# EAGLE design geiger_module (EAGLE 9.5.2)
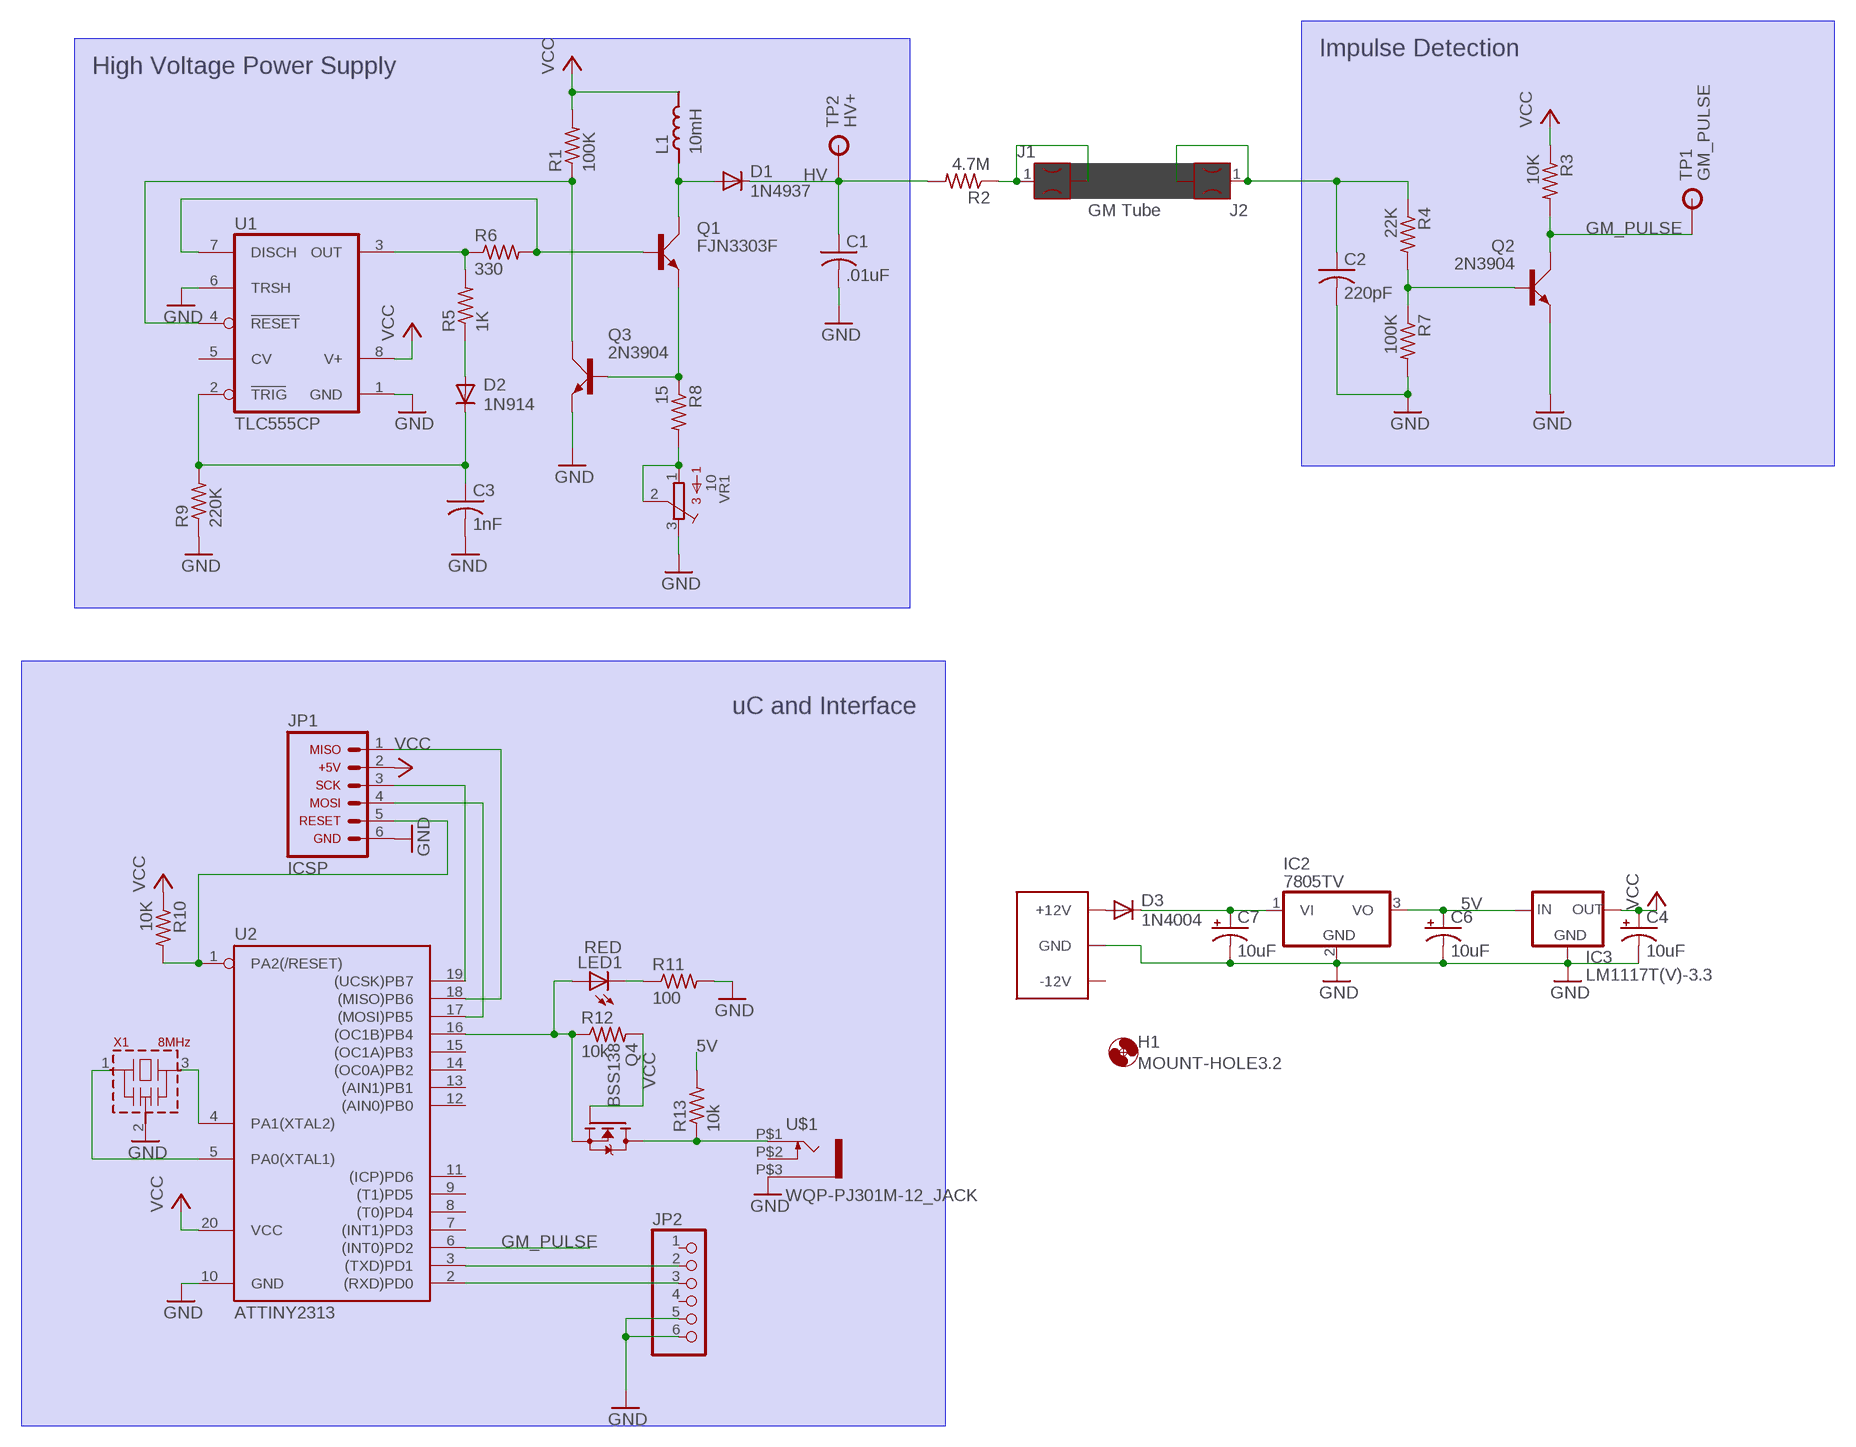
[diagram p0: schematic, sheet 1]

## Parts
C1  .01uF  C-US102-043X133  [C102-043X133]
C2  220pF  C-US050-030X075  [C050-030X075]
C3  1nF  C-US050-025X075  [C050-025X075]
C4  10uF  10UF-POLAR-RADIAL-2.5MM-25V-20%  [CPOL-RADIAL-2.5MM-5MM]
C6  10uF  10UF-POLAR-RADIAL-2.5MM-25V-20%  [CPOL-RADIAL-2.5MM-5MM]
C7  10uF  10UF-POLAR-RADIAL-2.5MM-25V-20%  [CPOL-RADIAL-2.5MM-5MM]
C8  EURO_POWER_LOCKSKINNY  [EURO_POWER_HEADER]
D1  1N4937  1N4933  [DO41-10]
D2  1N914  1N4148DO35-7  [DO35-7]
D3  1N4004  [DO41-10]
H1  MOUNT-HOLE3.2  [3,2]
IC2  7805TV  [TO220V]
IC3  LM1117T(V)-3.3  [TO220V]
J1  FUSECLIPPCMOUNT  [FUSECLIP_PCMOUNT]
J2  FUSECLIPPCMOUNT  [FUSECLIP_PCMOUNT]
JP1  ARDUINO_CONN-ICSP  [CONN-2X03]
JP2  PINHD-1X6  [1X06]
L1  10mH  INDELC09D  [ELC09D]
LED1  RED  LED5MM  [LED5MM]
Q1  FJN3303F  2N3704  [TO92C]
Q2  2N3904  [TO92D]
Q3  2N3904  [TO92D]
Q4  BSS138  [SOT23]
R1  100K  R-US_0207/10  [0207/10]
R2  4.7M  R-US_0207/10  [0207/10]
R3  10K  R-US_0207/10  [0207/10]
R4  22K  R-US_0207/10  [0207/10]
R5  1K  R-US_0207/10  [0207/10]
R6  330  R-US_0207/10  [0207/10]
R7  100K  R-US_0207/10  [0207/10]
R8  15  R-US_0207/10  [0207/10]
R9  220K  R-US_0207/10  [0207/10]
R10  10K  R-US_0207/10  [0207/10]
R11  100  R-US_0207/10  [0207/10]
R12  10k  R-US_0207/10  [0207/10]
R13  10k  R-US_0207/10  [0207/10]
TP1  GM_PULSE  TPPTH  [TP_PTH]
TP2  HV+  TPPTH  [TP_PTH]
U1  TLC555CP  ICM7555  [DIL08]
U2  ATTINY2313  TINY2313-*P*  [DIL20]
U$1  WQP-PJ301M-12_JACK  [WQP-PJ301M-12_JACK]
VR1  10  3386-P  [3386P]
X1  8MHz  CSTLA_T  [CSTLA_T]

## Nets
5V: C6.1(+) IC2.3(VO) IC3.3(IN) R13.2
12V: C7.1(+) D3.C IC2.1(VI)
GM_PULSE: Q2.C R3.2 TP1.P$1(TP) U2.6((INT0)PD2)
GND: C1.2 C2.2 C3.2 C4.2(-) C6.2(-) C7.2(-) C8.3(GND) C8.4(GND) C8.5(GND) C8.6(GND) C8.7(GND) C8.8(GND) IC2.2(GND) IC3.1(GND) JP1.6 JP2.5 JP2.6 Q2.E Q3.E R7.2 R9.1 R11.2 U1.1(GND) U1.6(TRSH) U2.10(GND) U$1.P$3 VR1.3 X1.2(VSS)
HV: C1.1 D1.C R2.2 TP2.P$1(TP)
N$1: D2.A R5.1
N$2: JP1.5 R10.2 U2.1(PA2(/RESET))
N$3: Q3.C R1.1 U1.4(RESET)
N$4: C8.9(+12V) C8.10(+12V) D3.A
N$5: JP1.3 U2.19((UCSK)PB7)
N$6: JP2.2 U2.3((TXD)PD1)
N$7: JP2.3 U2.2((RXD)PD0)
N$8: Q1.B R6.2 U1.7(DISCH)
N$9: C3.1 D2.C R9.2 U1.2(TRIG)
N$10: R5.2 R6.1 U1.3(OUT)
N$11: Q1.E Q3.B R8.1
N$12: D1.A L1.1 Q1.C
N$13: JP1.1 U2.18((MISO)PB6)
N$14: Q2.B R4.2 R7.1
N$15: J1.1 J1.2 R2.1
N$16: JP1.4 U2.17((MOSI)PB5)
N$18: U2.4(PA1(XTAL2)) X1.3
N$19: U2.5(PA0(XTAL1)) X1.1
N$21: LED1.K(C) R11.1
N$23: R8.2 VR1.1 VR1.2
N$39: C2.1 J2.1 J2.2 R4.1
PIN16: LED1.A Q4.2(S) R12.1 U2.16((OC1B)PB4)
PIN165V: Q4.3(D) R13.1 U$1.P$1
VCC: C4.1(+) IC3.2(OUT) JP1.2 L1.2 Q4.1(G) R1.2 R3.1 R10.1 R12.2 U1.8(V+) U2.20(VCC)
Unconnected: C8.1(-12V) C8.2(-12V) JP2.1 JP2.4 U1.5(CV) U2.7((INT1)PD3) U2.8((T0)PD4) U2.9((T1)PD5) U2.11((ICP)PD6) U2.12((AIN0)PB0) U2.13((AIN1)PB1) U2.14((OC0A)PB2) U2.15((OC1A)PB3) U$1.P$2

## Notes on the sheet
- Impulse Detection
- High Voltage Power Supply
- GM Tube
- uC and Interface

## Library data of the parts
C1-C3 = resistor:C-US: CAPACITOR, American symbol
C4 C6 C7 = SparkFun-Capacitors:10UF-POLAR: 10.0µF polarized capacitors A capacitor is a passive two-terminal electrical component used to store electrical energy temporarily in an electric field.; PROD_ID: CAP-08440
C8 = MusicThingModular:EURO_POWER_LOCK
D1 = diode:1N4933: DIODE fast recovery rectifier, 1A
D2 = diode:1N4148: DIODE high speed (Philips)
D3 = adafruit:1N4004: DIODE General purpose 1N400x type rectifier (With bigger pads) http://www.ladyada.net/library/pcb/eaglelibrary.html
H1 = holes:MOUNT-HOLE: MOUNTING HOLE with drill center marker
IC2 = linear:78*: Positive VOLTAGE REGULATOR Source: http://cache.national.com/ds/LM/LM78L05.pdf http://www.fairchildsemi.com/ds/LM/LM7805.pdf
IC3 = lm1117_10:LM1117?-*: 800mA Low-Dropout Linear Regulator Source: http://www.ti.com/lit/ds/symlink/lm1117-n.pdf; MF: Texas Instruments; MPN: LM1117T-3.3; OC_FARNELL: 1469056; OC_NEWARK: 13B5347
J1 J2 = connectors:FUSECLIP
JP1 = arduino_jw:ARDUINO_CONN-ICSP: Arduino ICSP I/O Header This is the ICSP I/O header on the Arduino Uno R3. This connector is labeled with the following pin assignments: MISO +5V SCK MOSI RESET GND NOTE: Be sure you install this connector with the correct orientation on your PCB layout. Pin 1 has a square pad to assist with orientation.
JP2 = pinhead:PINHD-1X6: PIN HEADER
L1 = passives:IND: Inductor
LED1 = mightyohm:LED: MightyOhm Engineering Light Emitting Diodes (LEDs)
Q1 = transistor-small-signal:2N3704: NPN TRANSISTOR
Q2 Q3 = transistor-small-signal:2N3904: NPN TRANSISTOR
Q4 = bss138_10:BSS138: BSS138 N-Channel Logic Level Enhancement Mode Field Effect Transistor Source: http://www.fairchildsemi.com/datasheets/BS/BSS138.pdf; MF: Fairchild; MPN: BSS138; OC_FARNELL: 9845330; OC_NEWARK: 67R2009
R1-R13 = resistor:R-US_: RESISTOR, American symbol
TP1 TP2 = connectors:TP: Test Point JSK 1/14/11
U1 = maxim:ICM7555: TIMER
U2 = avr-6:TINY2313*: Atmel Tiny2313 2K Flash, 128 bytes EEPROM, 128 bytes RAM
U$1 = thonkiconn:WQP-PJ301M-12_JACK
VR1 = BOURNS:3386-: 3386 Series 3/8" Square Trimmer
X1 = murata-resonators:CSTLA_T: Ceramic resonator 10.01 to 13.00 MHz

## Board
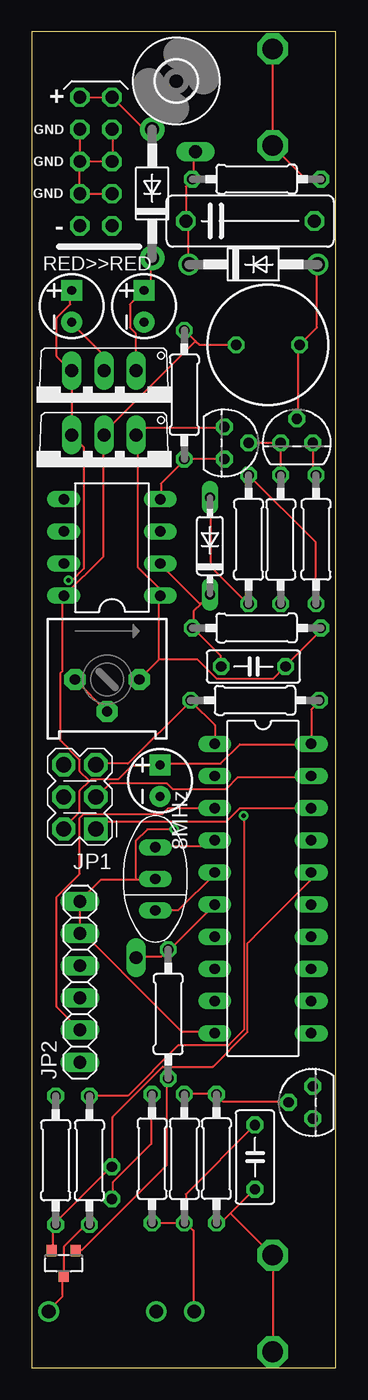
[diagram p1: board, top side]
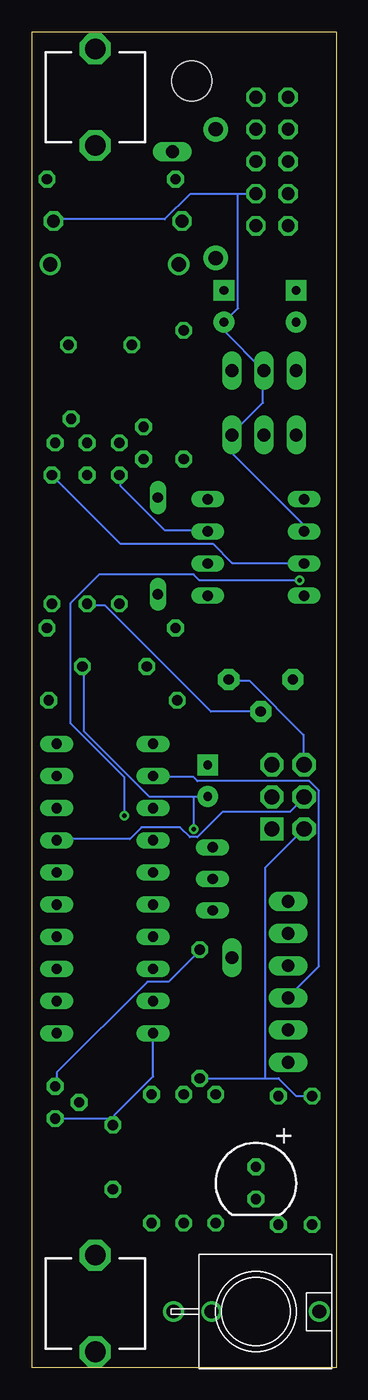
[diagram p2: board, bottom side, seen from below]

Size 24.04 x 105.5 mm. Coordinates in mm from the lower left corner, seen from the top.
Outline: 0,0 24.04,0 24.04,105.5 0,105.5 0,0
Copper layers (1*16): Top 0.035mm / dielectric 1.5mm / Bottom 0.035mm
Design rules "default": minimum track width 6mil, minimum drill 0.35mm, track to track 6mil, track to pad 6mil, pad to pad 6mil, via to via 6mil, smd to smd 6mil, copper to edge 40mil, drill to drill 6mil, minimum pad ring 10mil, minimum via ring 8mil, stop-mask expansion 4mil, vias tented up to drill 0mil, thermal gap 10mil

### Footprints (pad centres in the part's own frame; a part is rotated, then mirrored left to right if it is on the bottom)
C102-043X133 = drill 1.016 octagon: 1 -5.08,0; 2 5.08,0
C050-030X075 = drill 0.813 octagon: 1 -2.54,0; 2 2.54,0
C050-025X075 = drill 0.813 octagon: 1 -2.54,0; 2 2.54,0
CPOL-RADIAL-2.5MM-5MM = drill 0.7 pad 1.651 square: 1 1.25,0 | drill 0.7 pad 1.651: 2 -1.25,0
EURO_POWER_HEADER = drill 1.016 octagon: 1 -5.08,-1.27; 2 -5.08,1.27; 3 -2.54,-1.27; 4 -2.54,1.27; 5 0,-1.27; 6 0,1.27; 7 2.54,-1.27; 8 2.54,1.27; 9 5.08,-1.27; 10 5.08,1.27
DO41-10 = drill 1.118: A 5.08,0; C -5.08,0
DO35-7 = drill 0.813 long: A 3.81,0; C -3.81,0
DO41-10' = drill 1.118 pad 1.93: A 5.08,0; C -5.08,0
3,2 = hole 3.2: 0,0
TO220V = drill 1.016 long: 1 -2.54,-2.54; 2 0,-2.54; 3 2.54,-2.54
FUSECLIP_PCMOUNT = drill 1.626 octagon: 1 0,0; 2 7.62,0
CONN-2X03 = drill 1.2 pad 1.829 square: 1 0,0 | drill 1.2 pad 1.829 octagon: 2 2.54,0; 3 0,-2.54; 4 2.54,-2.54; 5 0,-5.08; 6 2.54,-5.08
1X06 = drill 1.016 long: 1 -6.35,0; 2 -3.81,0; 3 -1.27,0; 4 1.27,0; 5 3.81,0; 6 6.35,0
ELC09D = drill 0.813 octagon: 1 -2.5,0; 2 2.5,0
LED5MM = drill 0.813 octagon: A -1.27,0; K 1.27,0
TO92C = drill 0.813 octagon: B 1.27,0; C 0,1.905; E -1.27,0
TO92D = drill 0.813 octagon: B 0,1.905; C 1.27,0; E -1.27,0
SOT23 = smd 0.8 x 0.9: 1 -0.95,-1; 2 0.95,-1; 3 0,1
0207/10 = drill 0.813 octagon: 1 -5.08,0; 2 5.08,0
TP_PTH = drill 1.016 long: P$1 0,0
DIL08 = drill 0.813 long: 1 -3.81,-3.81; 2 -1.27,-3.81; 3 1.27,-3.81; 4 3.81,-3.81; 5 3.81,3.81; 6 1.27,3.81; 7 -1.27,3.81; 8 -3.81,3.81
DIL20 = drill 0.813 long: 1 -11.43,-3.81; 2 -8.89,-3.81; 3 -6.35,-3.81; 4 -3.81,-3.81; 5 -1.27,-3.81; 6 1.27,-3.81; 7 3.81,-3.81; 8 6.35,-3.81; 9 8.89,-3.81; 10 11.43,-3.81; 11 11.43,3.81; 12 8.89,3.81; 13 6.35,3.81; 14 3.81,3.81; 15 1.27,3.81; 16 -1.27,3.81; 17 -3.81,3.81; 18 -6.35,3.81; 19 -8.89,3.81; 20 -11.43,3.81
WQP-PJ301M-12_JACK = drill 1.1: P$1 0,5; P$2 0,-3.5; P$3 0,-6.5
3386P = drill 0.813 pad 1.676 octagon: 1 -2.54,0; 2 0,-2.54; 3 2.54,0
CSTLA_T = drill 0.813 long: 1 -2.5,0; 2 0,0; 3 2.5,0

### Placement (x,y rotation side)
C1  17.27,90.55 0 top
C2  17.65,16.64 90 top
C3  17.53,55.37 0 top
C4  10.16,46.35 90 top
C6  3.17,83.82 90 top
C7  8.89,83.82 90 top
C8  5.08,95.25 90 top
D1  17.53,87.12 0 top
D2  14.1,64.9 90 top
D3  1N4004  [DO41-10']  9.53,92.71 90 top
H1  11.43,101.6 0 top
IC2  5.71,76.2 180 top
IC3  5.71,71.12 180 top
J1  19.05,96.52 90 bottom
J2  19.05,1.27 90 bottom
JP1  5.08,42.55 180 top
JP2  3.81,30.48 90 top
L1  18.67,80.77 180 top
LED1  6.35,14.61 270 bottom
Q1  20.95,73.03 0 top
Q2  22.23,20.95 90 top
Q3  15.24,73.03 270 top
Q4  2.54,8.26 180 top
R1  12.06,76.83 90 top
R2  17.78,93.85 180 top
R3  10.79,27.94 90 top
R4  14.61,16.51 90 top
R5  17.14,65.41 90 top
R6  22.48,65.41 90 top
R7  12.06,16.51 270 top
R8  19.68,65.41 270 top
R9  17.78,58.42 180 top
R10  17.65,52.7 180 top
R11  9.53,16.51 270 top
R12  1.91,16.38 90 top
R13  4.57,16.38 90 top
TP1  8.26,32.38 270 top
TP2  12.95,96.01 0 top
U1  6.35,64.77 90 top
U2  18.29,37.85 270 top
U$1  6.35,4.45 270 bottom
VR1  5.97,54.36 0 top
X1  9.78,38.61 90 top

### Tracks (layer width: path | path; a pad name or v marks a point on that pad's centre or on a via)
5V  (via drill 0.35)
  Top 0.152: v16.76,43.59 16.76,26.67 15.54,25.45 11.58,25.45 7.62,21.49 4.57,21.49 R13.2 | v2.9,62.18 3.2,62.18 4.12,63.09 4.12,72.69 3.2,73.61 IC3.3 3.2,73.76 3.2,78.64 IC2.3 3.05,78.79 1.98,79.86 1.98,82.91 3.05,83.97 3.05,85.04 C6.1
  Bottom 0.152: v16.76,43.59 16.76,46.63 21.03,50.9 21.03,60.35 18.75,62.64 11.28,62.64 10.82,62.18 v2.9,62.18
12V
  Top 0.152: IC2.1 8.23,78.79 8.23,81.69 7.77,82.14 7.77,83.97 8.84,85.04 C7.1 8.99,85.19 9.45,85.65 9.45,87.63 D3.C
GM_PULSE
  Top 0.152: U2.6 10.82,32.92 R3.2 10.67,32.92 10.21,32.46 8.38,32.46 TP1.P$1
  Bottom 0.152: Q2.C 22.1,22.25 22.1,23.32 14.94,30.48 13.26,30.48 10.82,32.92 R3.2
GND  (via drill 0.35)
  Top 0.152: R11.2 R7.2 12.19,11.43 | 12.19,11.43 12.8,10.82 12.8,4.57 U$1.P$3 | 8.23,38.56 5.49,38.56 3.81,36.88 JP2.6 JP2.5 4.12,34.29 11.89,26.52 14.48,26.52 U2.10 | 8.23,38.56 9.75,38.56 X1.2 | 12.19,11.43 12.19,13.72 C2.2 | 10.06,55.93 10.06,60.96 | 10.06,55.93 8.53,54.41 VR1.3 | R9.1 22.86,58.22 20.12,55.47 C3.2 19.96,55.32 19.05,54.41 14.63,54.41 13.11,55.93 10.06,55.93 | C8.8 C8.6 | C8.7 6.4,97.69 6.4,95.25 C8.5 C8.6 | C8.3 6.25,92.66 3.81,92.66 C8.4 C8.6 | IC2.2 5.64,78.79 5.64,80.01 3.2,82.45 C6.2 | Q3.E 15.24,74.22 8.84,74.22 8.38,73.76 IC3.1 8.38,73.61 8.38,63.25 10.06,61.57 10.06,60.96 | 10.06,60.96 U1.1 | 8.23,38.56 8.23,41.6 9.14,42.52 v11.28,42.52
  Bottom 0.152: U2.10 14.48,23.01 17.53,19.96 17.53,19.66 | 17.53,19.66 17.53,19.2 C2.2 17.53,19.66 | 17.53,19.66 22.1,19.66 Q2.E | JP1.6 2.59,47.7 2.59,49.99 6.86,54.25 8.38,54.25 VR1.3 | 11.28,45.11 14.78,45.11 19.96,50.29 19.96,55.32 C3.2 | 11.28,45.11 10.21,45.11 C4.2 | 7.77,92.66 6.4,92.66 C8.3 | 7.77,92.66 11.58,92.66 13.56,90.68 22.25,90.68 C1.2 | U1.6 2.59,66.14 2.59,66.6 8.23,72.24 8.23,73.61 IC3.1 8.23,73.76 5.79,76.2 5.79,78.64 IC2.2 5.79,78.79 8.84,81.84 8.84,82.45 C7.2 8.84,82.6 7.77,83.67 7.77,92.66 | 11.28,45.11 v11.28,42.52
HV
  Top 0.152: TP2.P$1 12.8,95.86 12.8,93.88 R2.2 12.65,93.73 12.19,93.27 C1.1 12.19,90.53 12.34,90.37 12.34,87.17 D1.C
N$1
  Top 0.152: D2.A 14.17,68.58 14.17,63.25 17.07,60.35 R5.1
N$2
  Top 0.152: U2.1 14.48,50.75 12.65,52.58 R10.2 12.5,52.58 7.62,47.7 5.18,47.7 JP1.5
N$3
  Top 0.152: U1.4 10.21,68.58 10.21,69.8 12.04,71.63 R1.1 12.19,71.78 15.24,71.78 Q3.C
N$4
  Top 0.152: C8.10 3.81,100.28 6.25,100.28 C8.9 8.84,97.84 9.45,97.84 D3.A
N$5
  Top 0.152: U2.19 22.1,46.63 16.31,46.63 15.39,45.72 11.12,45.72 10.67,46.18 6.25,46.18 5.18,45.11 JP1.3
N$6
  Top 0.152: U2.3 10.82,44.2 10.36,43.74 4.12,43.74 3.81,43.43 3.81,39.01 1.98,37.19 1.98,28.5 JP2.2
N$7
  Bottom 0.152: U2.2 14.48,46.63 11.28,46.63 10.97,46.33 2.13,46.33 1.37,45.57 1.37,31.7 3.81,29.26 JP2.3
N$8
  Top 0.152: R6.2 22.25,70.71 22.25,73 Q1.B
  Bottom 0.152: R6.2 17.07,65.08 9.75,65.08 8.23,63.55 2.59,63.55 U1.7
N$9
  Top 0.152: 13.41,60.35 14.02,60.96 D2.C | 13.41,60.35 12.8,59.74 12.8,58.52 R9.2 12.8,58.37 14.94,56.24 14.94,55.47 C3.1 | 13.41,60.35 13.26,60.35 10.21,63.4 U1.2
N$10
  Top 0.152: R5.2 22.4,65.23 22.4,60.35 R6.1
  Bottom 0.152: U1.3 10.21,66.14 13.56,66.14 17.07,69.65 17.07,70.41 R5.2
N$11
  Top 0.152: 19.66,73 17.22,73 Q3.B | 19.66,73 19.66,70.56 R8.1 | 19.66,73 Q1.E
N$12
  Top 0.152: Q1.C 21.03,74.98 21.03,80.77 L1.1 21.18,80.77 22.55,82.14 22.55,87.02 D1.A
N$13
  Top 0.152: U2.18 16.46,44.2 15.39,43.13 5.64,43.13 5.18,42.67 JP1.1
N$14
  Top 0.152: R7.1 12.19,21.64 14.48,21.64 R4.2 14.63,21.49 15.09,21.03 20.27,21.03 Q2.B
N$15
  Top 0.152: R2.1 22.86,93.88 21.64,93.88 19.05,96.47 J1.1 J1.2
N$16
  Bottom 0.152: U2.17 22.1,41.76 16.31,41.76 15.39,42.67 12.34,42.67 11.58,41.91 10.97,41.91 8.99,43.89 3.66,43.89 2.59,44.96 JP1.4
N$18
  Top 0.152: X1.3 9.91,41.15 14.02,41.15 14.48,41.6 U2.4
N$19
  Top 0.152: X1.1 9.91,36.12 11.58,36.12 14.48,39.01 U2.5
N$21
  Top 0.152: LED1.K 6.4,13.41 6.4,14.63 9.45,17.68 9.45,21.49 R11.1
N$23
  Top 0.152: VR1.1 3.5,54.25 5.94,51.82 VR1.2
  Bottom 0.152: VR1.2 9.91,51.82 18.29,60.2 19.66,60.2 R8.2
N$39
  Top 0.152: R4.1 14.94,11.43 15.7,12.19 | 15.7,12.19 17.53,14.02 C2.1 | 19.05,8.84 15.7,12.19 | 19.05,8.84 J2.1 | 19.05,8.84 J2.2
PIN16
  Top 0.152: Q4.2 1.68,9.3 1.68,11.12 1.83,11.28 R12.1 1.83,11.43 6.25,15.85 LED1.A 6.4,16 6.4,19.81 10.36,23.77 14.33,23.77 17.07,26.52 17.07,33.53 22.1,38.56 U2.16
PIN165V
  Top 0.152: U$1.P$1 1.37,4.57 2.44,5.64 2.44,7.16 Q4.3 2.59,7.32 2.59,9.6 4.27,11.28 4.57,11.28 R13.1
VCC
  Top 0.152: L1.2 13.26,80.77 12.95,81.08 | 12.95,81.08 12.19,81.84 R1.2 | 12.95,81.08 5.64,73.76 IC3.2 5.64,73.61 5.64,64.01 2.59,60.96 U1.8 2.44,60.96 2.44,55.02 2.29,54.86 2.29,49.53 3.81,48.01 3.81,47.09 4.57,46.33 | Q4.1 3.5,9.3 3.96,9.3 10.67,16 10.67,22.86 R3.1 | R10.1 22.71,52.58 22.1,51.97 U2.20 22.1,49.23 16.46,49.23 14.94,47.7 10.21,47.7 C4.1 10.06,47.55 7.92,47.55 6.86,46.48 4.72,46.48 4.57,46.33 | 4.57,46.33 3.81,45.57 3.81,43.89 2.59,42.67 JP1.2
  Bottom 0.152: R3.1 5.64,22.86 | 5.64,22.86 4.57,22.86 3.2,21.49 1.98,21.49 R12.2 | 5.64,22.86 5.64,39.47 2.59,42.52 JP1.2